# Altium project Design 1 - Telemetry Module.PrjPcb (part 1 of 2)
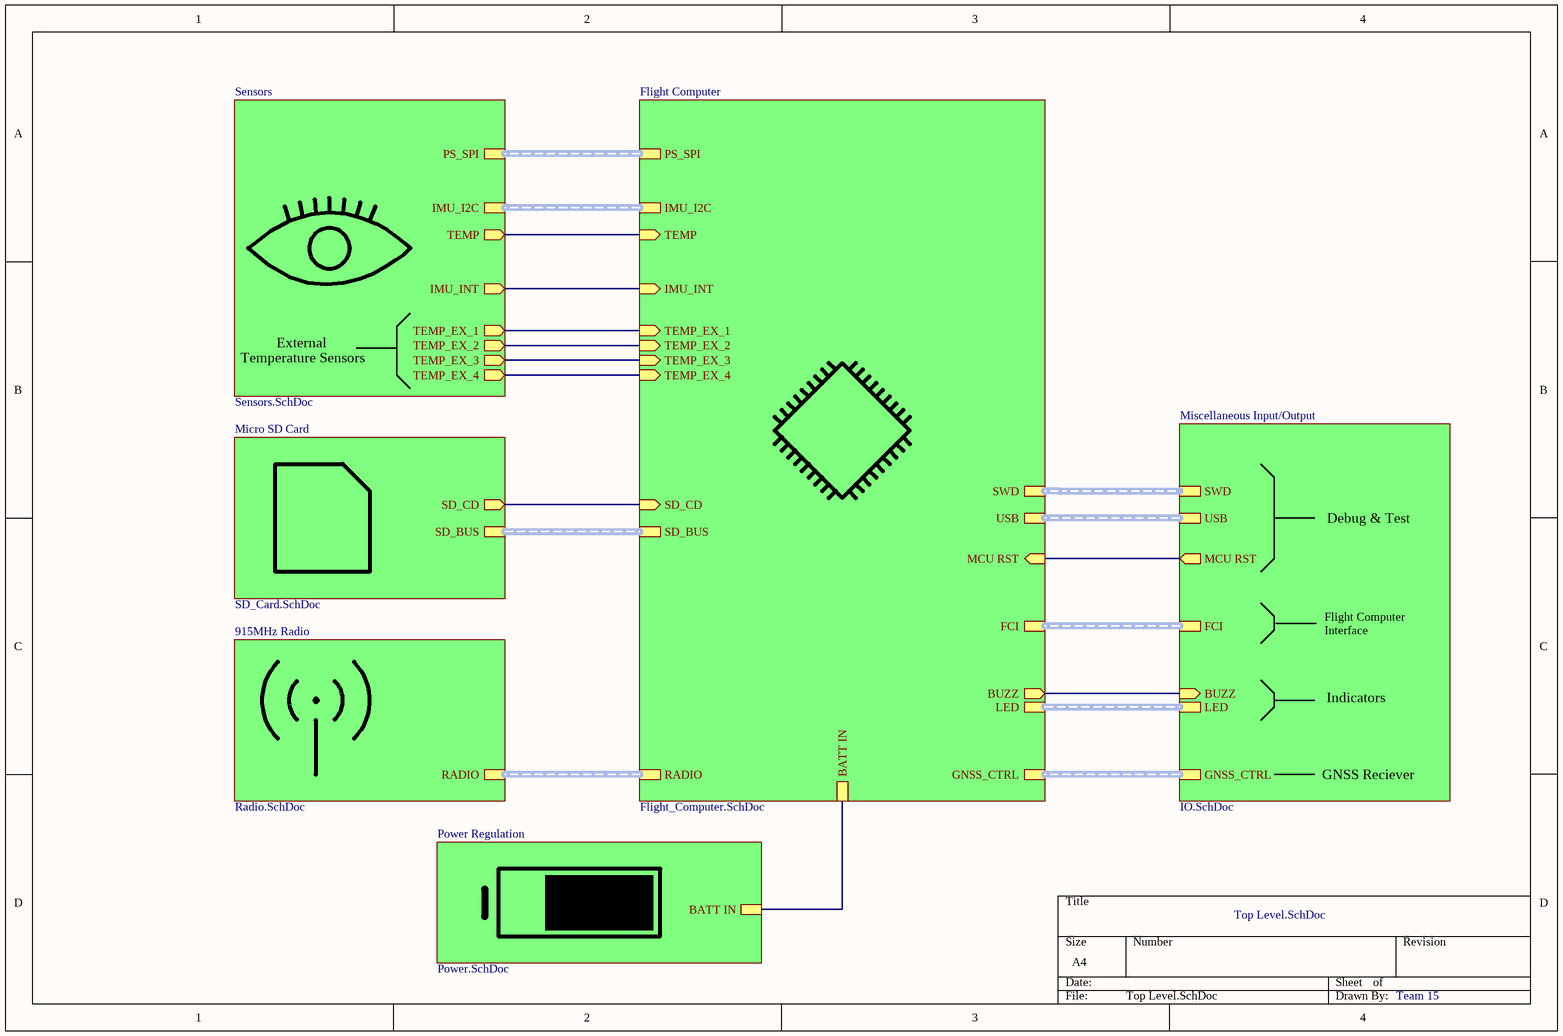
[diagram p0: Top Level.SchDoc]
7 sheets, 76 parts. Net scope: hierarchical (ports join the sheet entries above them; power ports are global).
Board file: Telemetry Module PCB.PcbDoc
Sheets:
  Top Level.SchDoc
    Flight Computer = Flight_Computer.SchDoc
    Micro SD Card = SD_Card.SchDoc
    915MHz Radio = Radio.SchDoc
    Sensors = Sensors.SchDoc
    Miscellaneous Input/Output = IO.SchDoc
    Power Regulation = Power.SchDoc

## Sheet Top Level.SchDoc: ELEC5551 Telemetry PCB
size A4; Author: Team 15; DrawnBy: Team 15; Engineer: Team 15; SheetNumber: 1; SheetTotal: 6

### Sub-sheets
915MHz Radio = Radio.SchDoc: RADIO (harness RADIO)
Flight Computer = Flight_Computer.SchDoc: SD_CD (in), TEMP (in), IMU_INT (in), BUZZ (out), MCU RST (in), GNSS_CTRL (harness GNSS_CTRL), IMU_I2C (harness IMU_I2C), LED (harness LED), PS_SPI (harness PS_SPI), RADIO (harness RADIO), SD_BUS (harness SD_BUS), USB (harness USB), SWD (harness SWD), BATT IN, FCI (harness Flight Computer Interface), TEMP_EX_1 (in), TEMP_EX_2 (in), TEMP_EX_3 (in), TEMP_EX_4 (in)
Micro SD Card = SD_Card.SchDoc: SD_CD (out), SD_BUS (harness SD_BUS)
Miscellaneous Input/Output = IO.SchDoc: LED (harness LED), GNSS_CTRL (harness GNSS_CTRL), MCU RST (out), BUZZ (in), USB (harness USB), SWD (harness SWD), FCI (harness Flight Computer Interface)
Power Regulation = Power.SchDoc: BATT IN
Sensors = Sensors.SchDoc: TEMP (out), IMU_INT (out), PS_SPI (harness PS_SPI), IMU_I2C (harness IMU_I2C), TEMP_EX_1 (out), TEMP_EX_2 (out), TEMP_EX_3 (out), TEMP_EX_4 (out)

### Nets
NetC3_2: sheet Flight Computer/MCU RST, sheet Miscellaneous Input/Output/MCU RST
NetC24_2: sheet Flight Computer/TEMP, sheet Sensors/TEMP
NetC25_2: sheet Flight Computer/TEMP_EX_1, sheet Sensors/TEMP_EX_1
NetC26_2: sheet Flight Computer/TEMP_EX_3, sheet Sensors/TEMP_EX_3
NetC27_2: sheet Flight Computer/TEMP_EX_2, sheet Sensors/TEMP_EX_2
NetC28_2: sheet Flight Computer/TEMP_EX_4, sheet Sensors/TEMP_EX_4
NetD4_1: sheet Flight Computer/BATT IN, sheet Power Regulation/BATT IN
NetIC2_51: sheet Flight Computer/IMU_INT, sheet Sensors/IMU_INT
NetIC2_54: sheet Flight Computer/BUZZ, sheet Miscellaneous Input/Output/BUZZ
NetIC2_64: sheet Flight Computer/SD_CD, sheet Micro SD Card/SD_CD

### Buses and harness runs
harness sheet 915MHz Radio/RADIO = sheet Flight Computer/RADIO
harness sheet Flight Computer/FCI = sheet Miscellaneous Input/Output/FCI
harness sheet Flight Computer/GNSS_CTRL = sheet Miscellaneous Input/Output/GNSS_CTRL
harness sheet Flight Computer/IMU_I2C = sheet Sensors/IMU_I2C
harness sheet Flight Computer/LED = sheet Miscellaneous Input/Output/LED
harness sheet Flight Computer/PS_SPI = sheet Sensors/PS_SPI
harness sheet Flight Computer/SD_BUS = sheet Micro SD Card/SD_BUS
harness sheet Flight Computer/SWD = sheet Miscellaneous Input/Output/SWD
harness sheet Flight Computer/USB = sheet Miscellaneous Input/Output/USB

### Notes on the sheet
- Temperature Sensors
- External
- Debug & Test
- Flight Computer Interface
- Indicators
- GNSS Reciever

## Sheet Flight_Computer.SchDoc
size A4; SheetNumber: 6; SheetTotal: 7
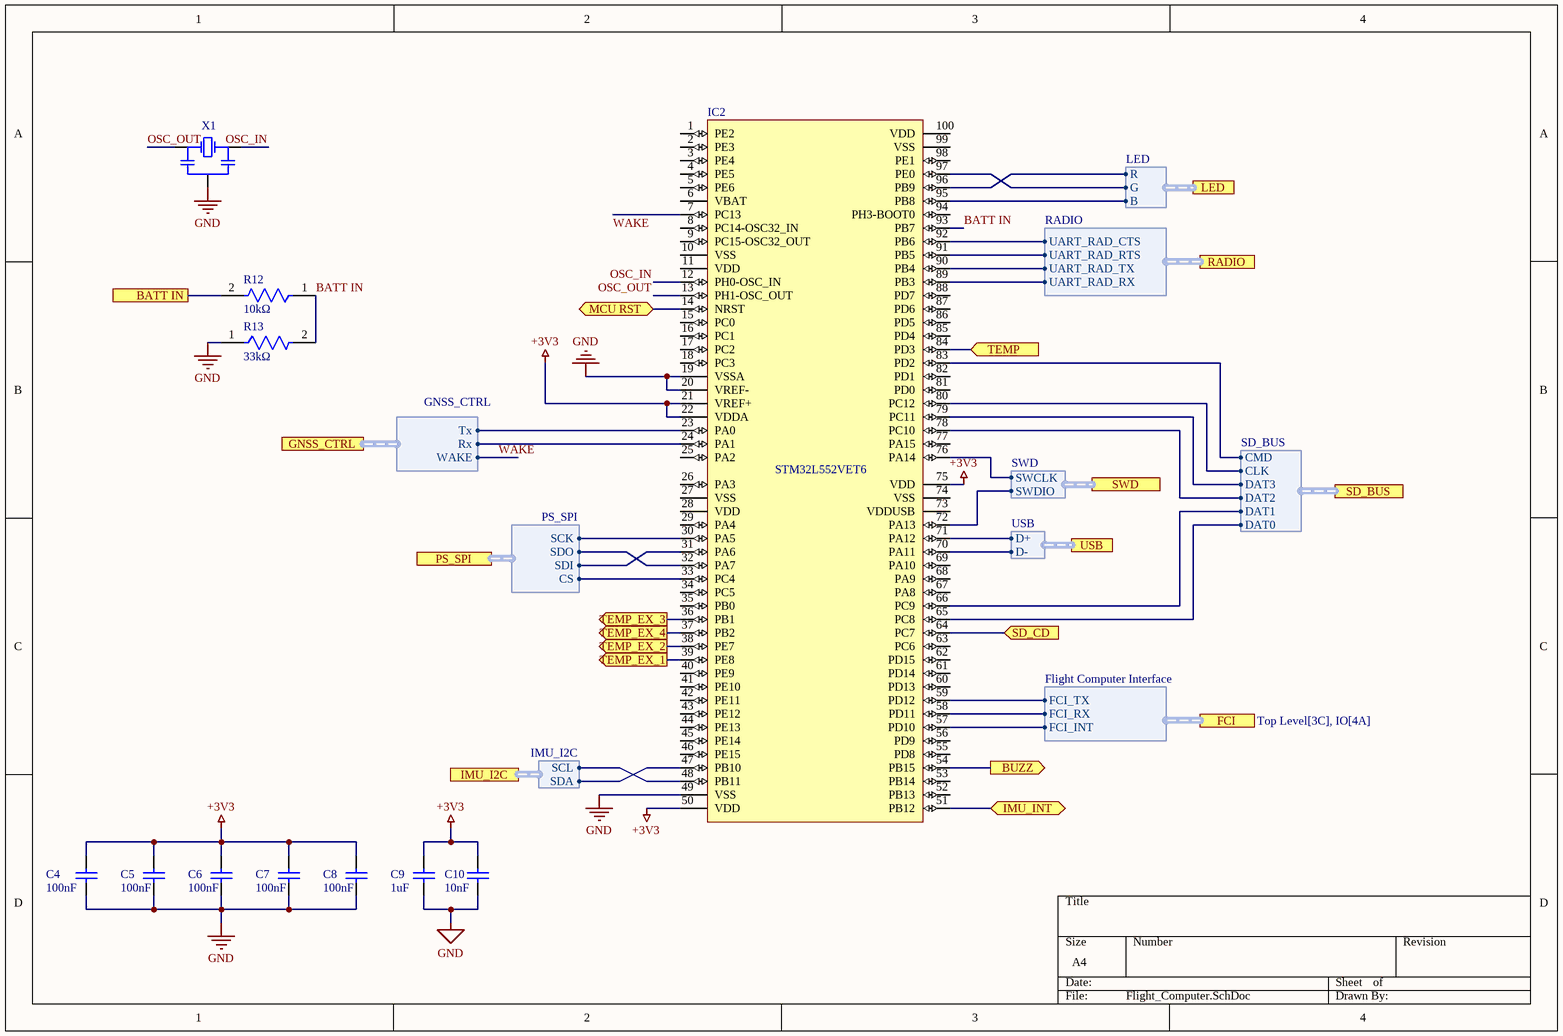
[diagram p1: Flight_Computer.SchDoc]

### Parts
C4  value 100nF  [CAPC1608X10N]  (hidden comment: C0603C104M5RACTU)
C5  value 100nF  [CAPC1608X10N]  (hidden comment: C0603C104M5RACTU)
C6  value 100nF  [CAPC1608X10N]  (hidden comment: C0603C104M5RACTU)
C7  value 100nF  [CAPC1608X10N]  (hidden comment: C0603C104M5RACTU)
C8  value 100nF  [CAPC1608X10N]  (hidden comment: C0603C104M5RACTU)
C9  value 1uF  [CAPC1608X10N]  (hidden comment: C0603C105K8PACTU)
C10  value 10nF  [CAPC1608X10N]  (hidden comment: C0603C103J5RACTU)
IC2  STM32L552VET6  [TSQFP50P1600X1600X160-100N]
R12  10kΩ  [FP-RT0603-MFG]
R13  33kΩ  [FP-CRCW0603-e3-IPC_A]
X1  CSTNE16M0V530000R0  [FP-CSTNE16M0V530000R0-MFG]  (value not drawn)

### Ports
BATT IN (see Top Level[3D], Power[2B]), BUZZ (out, see Top Level[3C], IO[3B]), FCI (harness Flight Computer Interface, see Top Level[3C], IO[4A]), GNSS_CTRL (harness GNSS_CTRL, see Top Level[3D], IO[2B]), IMU_I2C (harness IMU_I2C, see Top Level[2A], Sensors[3C]), IMU_INT (bidir, see Top Level[2B], Sensors[1C]), LED (harness LED, see Top Level[3C], IO[3C]), MCU RST (bidir, see Top Level[3C], IO[2A], IO[2C]), PS_SPI (harness PS_SPI, see Top Level[2A], Sensors[1A]), RADIO (harness RADIO, see Top Level[2D], Radio[3B]), SD_BUS (harness SD_BUS, see Top Level[2C], SD_Card[1B]), SD_CD (in, see Top Level[2B], SD_Card[4B]), SWD (harness SWD, see Top Level[3B], IO[3B]), TEMP (in, see Top Level[2A], Sensors[4A]), TEMP_EX_1 (out, see Top Level[2B], Sensors[4B]), TEMP_EX_2 (out, see Top Level[2B], Sensors[4C]), TEMP_EX_3 (out, see Top Level[2B], Sensors[4B]), TEMP_EX_4 (out, see Top Level[2B], Sensors[4C]), USB (harness USB, see Top Level[3C], IO[1C])

### Harnesses
SD_BUS: CLK, CMD, DAT0, DAT1, DAT2, DAT3
IMU_I2C: SCL, SDA
RADIO: UART_RAD_CTS, UART_RAD_RTS, UART_RAD_TX, UART_RAD_RX
PS_SPI: SCK, SDI, SDO, CS
USB: D+, D-
SWD: SWCLK, SWDIO
LED: B, G, R
GNSS_CTRL: Rx, Tx, WAKE
Flight Computer Interface: FCI_TX, FCI_RX, FCI_INT

### Nets
+3V3: C4.2 C5.2 C6.2 C7.2 C8.2 C9.2 C10.2 IC2.21(VREF+) IC2.22(VDDA) IC2.50(VDD) IC2.75(VDD)
GND: C4.1 C5.1 C6.1 C7.1 C8.1 C9.1 C10.1 IC2.19(VSSA) IC2.20(VREF-) IC2.49(VSS) R13.1 X1.2(GND)
BATT IN: IC2.93(PB7) R12.1 R13.2
CLK: IC2.80(PC12) ; port SD_BUS.CLK
CMD: IC2.83(PD2) ; port SD_BUS.CMD
D2_N: IC2.70(PA11) ; port USB.D-
D2_P: IC2.71(PA12) ; port USB.D+
DAT0: IC2.65(PC8) ; port SD_BUS.DAT0
DAT1: IC2.66(PC9) ; port SD_BUS.DAT1
DAT2: IC2.78(PC10) ; port SD_BUS.DAT2
DAT3: IC2.79(PC11) ; port SD_BUS.DAT3
OSC_IN: IC2.12(PH0-OSC_IN) X1.1(OSC_IN)
OSC_OUT: IC2.13(PH1-OSC_OUT) X1.3(OSC_OUT)
Rx: IC2.24(PA1) ; port GNSS_CTRL.Rx
SCK: IC2.30(PA5) ; port PS_SPI.SCK
SDI: IC2.31(PA6) ; port PS_SPI.SDI
SDO: IC2.32(PA7) ; port PS_SPI.SDO
Tx: IC2.23(PA0) ; port GNSS_CTRL.Tx
WAKE: IC2.7(PC13) ; port GNSS_CTRL.WAKE
NetC3_2: IC2.14(NRST) ; port MCU RST
NetC24_2: IC2.84(PD3) ; port TEMP
NetC25_2: IC2.39(PE8) ; port TEMP_EX_1
NetC26_2: IC2.36(PB1) ; port TEMP_EX_3
NetC27_2: IC2.38(PE7) ; port TEMP_EX_2
NetC28_2: IC2.37(PB2) ; port TEMP_EX_4
NetD3_2: IC2.95(PB8) ; port LED.B
NetD3_5: IC2.96(PB9) ; port LED.R
NetD3_6: IC2.97(PE0) ; port LED.G
NetD4_1: R12.2 ; port BATT IN
NetIC2_33: IC2.33(PC4) ; port PS_SPI.CS
NetIC2_47: IC2.47(PB10) ; port IMU_I2C.SDA
NetIC2_48: IC2.48(PB11) ; port IMU_I2C.SCL
NetIC2_51: IC2.51(PB12) ; port IMU_INT
NetIC2_54: IC2.54(PB15) ; port BUZZ
NetIC2_57: IC2.57(PD10) ; port FCI.FCI_INT
NetIC2_58: IC2.58(PD11) ; port FCI.FCI_RX
NetIC2_59: IC2.59(PD12) ; port FCI.FCI_TX
NetIC2_64: IC2.64(PC7) ; port SD_CD
NetIC2_72: IC2.72(PA13) ; port SWD.SWDIO
NetIC2_76: IC2.76(PA14) ; port SWD.SWCLK
NetIC2_89: IC2.89(PB3) ; port RADIO.UART_RAD_RX
NetIC2_90: IC2.90(PB4) ; port RADIO.UART_RAD_TX
NetIC2_91: IC2.91(PB5) ; port RADIO.UART_RAD_RTS
NetIC2_92: IC2.92(PB6) ; port RADIO.UART_RAD_CTS

Not connected (* = marked no-connect by the designer): IC2 1(PE2) 2(PE3) 3(PE4) 4(PE5) 5(PE6) 6(VBAT) 8(PC14-OSC32_IN) 9(PC15-OSC32_OUT) 10(VSS) 11(VDD) 15(PC0) 16(PC1) 17(PC2) 18(PC3) 25(PA2) 26(PA3) 27(VSS) 28(VDD) 29(PA4) 34(PC5) 35(PB0) 40(PE9) 41(PE10) 42(PE11) 43(PE12) 44(PE13) 45(PE14) 46(PE15) 52(PB13) 53(PB14) 55(PD8) 56(PD9) 60(PD13) 61(PD14) 62(PD15) 63(PC6) 67(PA8) 68(PA9) 69(PA10) 73(VDDUSB) 74(VSS) 77(PA15) 81(PD0) 82(PD1) 85(PD4) 86(PD5) 87(PD6) 88(PD7) 94(PH3-BOOT0) 98(PE1) 99(VSS) 100(VDD)

### Library data of the parts
C4-C8 = CMP-00038-5: Cap Ceramic 0.1uF 50V X7R 20% SMD 0603 125C T/R; Dissipation Factor: 2.5%; Min Operating Temperature: -55°C; Contact Plating: Tin,Matte; Height: 0.8mm; Voltage Rating: 50V; REACH SVHC: No SVHC; Max Operating Temperature: 125°C; Termination: SMD/SMT; Package Quantity: 1; Capacitance: 100nF; Packaging: Tape and Reel; Width: 0.031inch; Depth: 0.8mm; Dielectric: X7R; Tolerance: 20%; Lead Pitch: 0.7mm; Thickness: 0.034inch; Length: 1.6mm; Dielectric Material: Ceramic; Radiation Hardening: No; Voltage Rating (DC): 50V; Case/Package: 0603; Case Code (Metric): 1608; Mount: Surface Mount,PCB; Case Code (Imperial): 0603; JLC_PN: C14663
C9 = CMP-00045-2: Cap Ceramic 1uF 10V X5R 10% SMD 0603 85°C Paper T/R; Capacitance: 1uF; Voltage Rating (DC): 10V; Case/Package: 0603; Height: 0.8mm; Tolerance: 10%; Width: 0.031inch; Lead Free: Lead Free; Mount: Surface Mount; Length: 1.6mm; Number of Pins: 2; Radiation Hardening: No; Dielectric: X5R; Voltage: 10V; Depth: 0.8mm; Weight: 7.1E-05oz; REACH SVHC: No SVHC; Package Quantity: 1; Max Operating Temperature: 85°C; Case Code (Imperial): 0603; Thickness: 0.035inch; Min Operating Temperature: -55°C; Dielectric Material: Ceramic; Case Code (Metric): 1608; Packaging: Tape and Reel; Voltage Rating: 10V; Termination: SMD/SMT; JLC_PN: C15849
C10 = CMP-00047-2: Cap Ceramic 0.01uF 50V X7R 5% SMD 0603 125C Paper T/R; Dielectric: X7R; Case/Package: 0603; Height: 0.8mm; Capacitance: 10nF; Depth: 0.8mm; Length: 1.6mm; Min Operating Temperature: -55°C; Radiation Hardening: No; Packaging: Tape and Reel; Max Operating Temperature: 125°C; Mount: Surface Mount; Tolerance: 5%; JLC_PN: C57112
IC2 = CMP-00012-1: STM32L Series 512 kB Flash 256 KB RAM SMT 32-Bit Microcontroller - LQFP-100
R12 = CMP-2000-04608-2: RES SMD 10K OHM 0.5% 1/10W 0603; Manufacturer Part Number: RT0603DRE0710KL; Manufacturer: Yageo; Tolerance: 0.005; Temperature Coefficient: 50 ppm/°C; Voltage Rating: 75V; Power Rating: 0.1W; Temperature Range Low: -55°C; ComponentLink2Description: Datasheet; RoHS: TRUE; Device Class L1: Passive Components; Octopart: https://octopart.com/rt0603dre0710kl-yageo-1185844; Mouser Description: Thin Film Resistors - SMD 10K ohm 0.5% 1/10W; Automotive: No; Device Class L2: Resistors; Device Class L3: Chip SMD Resistors; Footprint Url: http://www.yageo.com/exep/pages/download/literatures/PYu-R_Mount_10.pdf; Temperature Range High: +155°C; Series: RT; Value: 10KΩ; Package: RT0603; Resistance: 10KΩ; Category: Res; Temperature: -55°C to +155°C; Height: 0.55mm; ComponentLink2URL: http://www.yageo.com/documents/recent/PYu-RT_1-to-0.01_RoHS_L_9.pdf; Lead Free: Yes; Composition: Thin Film; Digikey Description: RES SMD 10K OHM 0.5% 1/10W 0603; Ipc Land Pattern Name: RESC16080X45
R13 = CMP-2000-03245-2: RES Thick Film, 33kΩ, 1%, 0.1W, 100ppm/°C, 0603; Voltage Rating: 75V; Resistance: 33kR; Max Power Dissipation: 100mW; Contact Plating: Tin; Min Operating Temperature: -55°C; Radiation Hardening: No; Package Quantity: 10; Tolerance: 1%; Termination: SMD/SMT; Case Code (Metric): 1608; Military Standard: Not; Packaging: Tape and Reel; Case/Package: 0603; Composition: Thick Film; Depth: 0.85mm; Weight: 7.1E-05oz; Max Operating Temperature: 155°C; Height: 0.45mm; Features: Automotive AEC-Q200; Width: 0.033inch; Length: 1.55mm; Power Rating: 100mW; Voltage Rating (DC): 75V; Temperature Coefficient: 100ppm/°C; Case Code (Imperial): 0603; Mount: Surface Mount; Number of Terminations: 2; Lead Free: Lead Free
X1 = CMP-00029-1: CER RES 16.0000MHZ 15PF SMD; Frequency Tolerance: 0.5%; Frequency: 16MHz; Impedance: 40R; Frequency Stability: 0.3%; Capacitance: 15pF; Max Operating Temperature: 85°C; Mount: Surface Mount; Min Operating Temperature: -40°C; Case/Package: SMD/SMT; Packaging: Tape and Reel; Composition: Ceramic

## Sheet SD_Card.SchDoc
size A4; SheetNumber: 3; SheetTotal: 7
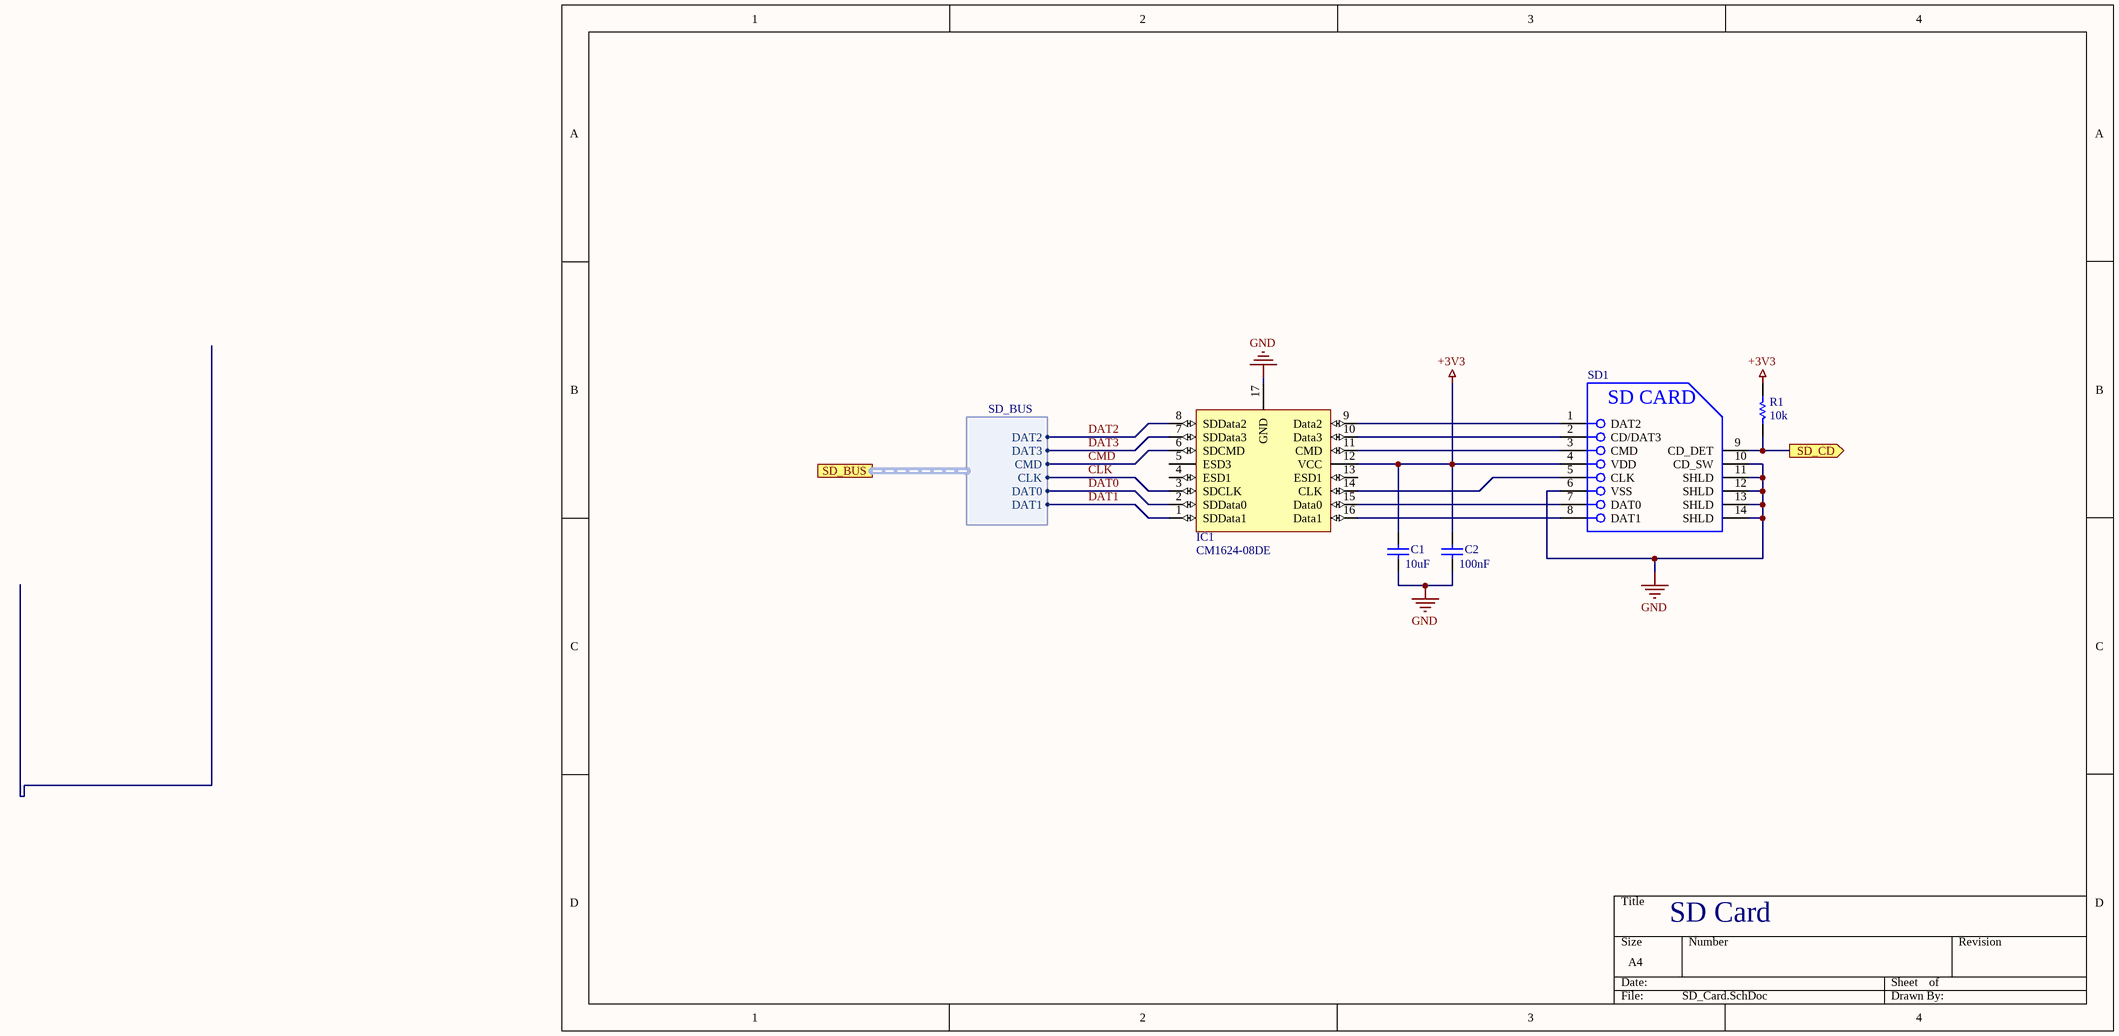
[diagram p2: SD_Card.SchDoc]

### Parts
C1  value 10uF  [CAPC2012X14N]  (hidden comment: C0805C106K8PACTU)
C2  value 100nF  [CAPC1608X10N]  (hidden comment: C0603C104M5RACTU)
IC1  CM1624-08DE  [SON40P140X55_HS-17N]
R1  value 10k  [RESC1608X06N]  (hidden comment: CRCW060310K0FKEA)
SD1  5027740891  [5027740891-Footprint-1]  (value not drawn)

### Ports
SD_BUS (harness SD_BUS, see Top Level[2C], Flight_Computer[4B]), SD_CD (out, see Top Level[2B], Flight_Computer[3C])

### Harnesses
SD_BUS: DAT1, DAT0, CLK, CMD, DAT3, DAT2

### Nets
+3V3: C1.2 C2.2 IC1.12(VCC) R1.2 SD1.4(VDD)
GND: C1.1 C2.1 IC1.17(GND) SD1.6(VSS) SD1.10(CD_SW) SD1.11(SHLD) SD1.12(SHLD) SD1.13(SHLD) SD1.14(SHLD)
CLK: IC1.3(SDCLK) ; port SD_BUS.CLK
CMD: IC1.6(SDCMD) ; port SD_BUS.CMD
DAT0: IC1.2(SDData0) ; port SD_BUS.DAT0
DAT1: IC1.1(SDData1) ; port SD_BUS.DAT1
DAT2: IC1.8(SDData2) ; port SD_BUS.DAT2
DAT3: IC1.7(SDData3) ; port SD_BUS.DAT3
NetIC1_9: IC1.9(Data2) SD1.1(DAT2)
NetIC1_10: IC1.10(Data3) SD1.2(CD/DAT3)
NetIC1_11: IC1.11(CMD) SD1.3(CMD)
NetIC1_14: IC1.14(CLK) SD1.5(CLK)
NetIC1_15: IC1.15(Data0) SD1.7(DAT0)
NetIC1_16: IC1.16(Data1) SD1.8(DAT1)
NetIC2_64: R1.1 SD1.9(CD_DET) ; port SD_CD

Not connected (* = marked no-connect by the designer): IC1 4(ESD1) 5(ESD3) 13(ESD1)

### Notes on the sheet
- SD Card
- (in symbol CMP-00007-2) SD CARD

### Library data of the parts
C1 = CMP-00046-3: CAP CER 10UF 10V X5R 0805; Dielectric Material: Ceramic; Dissipation Factor: 10%; Width: 1.2mm; Number of Pins: 2; Voltage: 10V; Packaging: Tape and Reel; Dielectric: X5R; Mount: Surface Mount; Case/Package: 0805; Thickness: 0.055inch; Package Quantity: 1; Voltage Rating (DC): 10V; Case Code (Imperial): 0805; Tolerance: 10%; Max Operating Temperature: 85°C; Radiation Hardening: No; Termination: SMD/SMT; Height: 1.25mm; Voltage Rating: 10V; Capacitance: 10uF; Length: 2mm; Min Operating Temperature: -55°C; Depth: 1.25mm; REACH SVHC: No SVHC; Case Code (Metric): 2012; Contact Plating: Tin,Matte; JLC_PN: C15850
C2 = CMP-00038-5: as C4 on sheet Flight_Computer; Min Operating Temperature: -55°C; Contact Plating: Tin,Matte; Height: 0.8mm; Voltage Rating: 50V; REACH SVHC: No SVHC; Max Operating Temperature: 125°C; Termination: SMD/SMT; Package Quantity: 1; Capacitance: 100nF; Packaging: Tape and Reel; Width: 0.031inch; Depth: 0.8mm; Dielectric: X7R; Tolerance: 20%; Lead Pitch: 0.7mm; Thickness: 0.034inch; Length: 1.6mm; Dielectric Material: Ceramic; Radiation Hardening: No; Voltage Rating (DC): 50V; Case/Package: 0603; Case Code (Metric): 1608; Mount: Surface Mount,PCB; Case Code (Imperial): 0603; JLC_PN: C14663
IC1 = CMP-00015-3: EMI Filter Flat Style SMD T/R; Capacitance: 20pF; Operating Supply Voltage: 5V; ESD Protection: Yes; Clamping Voltage: 9V; DC Resistance (DCR): 40R; Number of Channels: 6; Number of Lines: 8; Direction: Bidirectional; Depth: 1.45mm; Length: 3.4mm; Height: 0.022inch; Halogen Free: Halogen Free; REACH SVHC: No SVHC; Contact Plating: Tin,Matte; Number of Pins: 16; Termination: Flat; Package Quantity: 1; Min Operating Temperature: -40°C; Lead Free: Lead Free; Packaging: Tape and Reel; Case/Package: DFN; Max Operating Temperature: 85°C; Width: 1.35mm
R1 = CMP-00042-5: VISHAY - CRCW060310K0FKEA - SMD Chip Resistor, 0603 [1608 Metric], 10 kohm, CRCW e3 Series, 75 V, Thick Film, 100 mW; Voltage Rating: 75V; Temperature Coefficient: 100ppm/°C; Resistance: 10kR; Power Rating: 100mW; Tolerance: 1%; Number of Terminations: 2; Termination: SMD/SMT; Weight: 7.1E-05oz; Contact Plating: Tin,Lead; Max Operating Temperature: 155°C; Voltage Rating (DC): 75V; Military Standard: Not; Min Operating Temperature: -55°C; Depth: 0.85mm; Lead Free: Lead Free; Width: 0.033inch; Max Power Dissipation: 100mW; Features: Automotive AEC-Q200; Number of Pins: 2; Package Quantity: 10; Case/Package: 0603; Height: 0.45mm; Radiation Hardening: No; REACH SVHC: Unknown; Packaging: Tape and Reel; Length: 1.55mm; Case Code (Metric): 1608; Case Code (Imperial): 0603; Composition: Thick Film; JLC_PN: C25804
SD1 = CMP-00007-2: MOLEX   502774-0891.   MEMORY CARD CONNECTOR, MICROSD, 8POS; Current Rating: 500mA; Number of Contacts: 8; Pitch: 1.1mm; Gender: Male; Max Voltage Rating (DC): 1.01kV; Voltage Rating (AC): 10V; Max Operating Temperature: 85°C; Radiation Hardening: No; Depth: 16mm; Number of Rows: 1; Mount: Surface Mount,Reverse; Height: 1.8mm; Min Operating Temperature: -25°C; Length: 14.6mm; Package Quantity: 1; Contact Material: Copper Alloy,Copper; Housing Material: Polymer; Width: 1.8mm; Contact Plating: Gold; Orientation: Right Angle; Number of Circuits: 8; REACH SVHC: Unknown; Packaging: Tape and Reel; Halogen Free: Low Halogen; Termination: Solder; Connector Type: Connector

## Sheet Radio.SchDoc
size A4; SheetNumber: 7; SheetTotal: 7
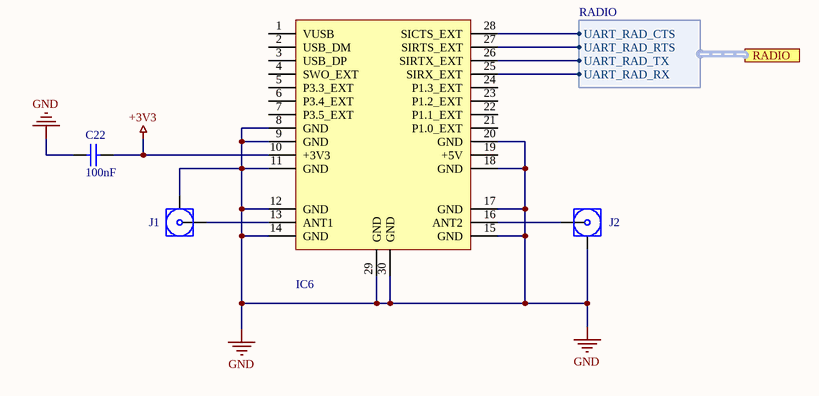
[diagram p3: Radio.SchDoc]

### Parts
C22  value 100nF  [CAPC1608X10N]  (hidden comment: C0603C104M5RACTU)
IC6  RFD900ux  [RFD900ux-Footprint-1]  (value not drawn)
J1  PCB.SMAFST.J.A.HT  [PCB.SMAFST.J.A.HT-Footprint-1]  (value not drawn)
J2  PCB.SMAFST.J.A.HT  [PCB.SMAFST.J.A.HT-Footprint-1]  (value not drawn)

### Ports
RADIO (harness RADIO, see Top Level[2D], Flight_Computer[4B])

### Harnesses
RADIO: UART_RAD_CTS, UART_RAD_RTS, UART_RAD_TX, UART_RAD_RX

### Nets
+3V3: C22.2 IC6.10(+3V3)
GND: C22.1 IC6.8(GND) IC6.9(GND) IC6.11(GND) IC6.12(GND) IC6.14(GND) IC6.15(GND) IC6.17(GND) IC6.18(GND) IC6.20(GND) IC6.29(GND) IC6.30(GND) J1.2(GND) J2.2(GND)
NetIC2_89: IC6.25(SIRX_EXT) ; port RADIO.UART_RAD_RX
NetIC2_90: IC6.26(SIRTX_EXT) ; port RADIO.UART_RAD_TX
NetIC2_91: IC6.27(SIRTS_EXT) ; port RADIO.UART_RAD_RTS
NetIC2_92: IC6.28(SICTS_EXT) ; port RADIO.UART_RAD_CTS
NetIC6_13: IC6.13(ANT1) J1.1(SIG)
NetIC6_16: IC6.16(ANT2) J2.1(SIG)

Not connected (* = marked no-connect by the designer): IC6 1(VUSB) 2(USB_DM) 3(USB_DP) 4(SWO_EXT) 5(P3.3_EXT) 6(P3.4_EXT) 7(P3.5_EXT) 19(+5V) 21(P1.0_EXT) 22(P1.1_EXT) 23(P1.2_EXT) 24(P1.3_EXT)

### Library data of the parts
C22 = CMP-00038-5: as C4 on sheet Flight_Computer; Dielectric Material: Ceramic; Voltage Rating: 50V; Lead Pitch: 0.7mm; Package Quantity: 1; Case Code (Metric): 1608; Tolerance: 20%; Termination: SMD/SMT; Min Operating Temperature: -55°C; Height: 0.8mm; Voltage Rating (DC): 50V; Contact Plating: Tin,Matte; Case/Package: 0603; Capacitance: 100nF; Length: 1.6mm; Dielectric: X7R; Depth: 0.8mm; Mount: Surface Mount,PCB; Thickness: 0.034inch; Width: 0.031inch; REACH SVHC: No SVHC; Packaging: Tape and Reel; Case Code (Imperial): 0603; Max Operating Temperature: 125°C; Radiation Hardening: No; JLC_PN: C14663
IC6 = CMP-00019-3: Long range surface mount radio module 902-928Mhz
J1 J2 = CMP-00234-3: CONN SMA JACK STR 50OHM PCB; Impedance: 50R; Body Plating: Gold; Polarity: Standard; Operating Frequency: 0 to 12.4 GHz; Max Frequency: 12.4GHz; Insulation Resistance: 5GR; Voltage Rating: 335V; Dielectric Material: PTFE; Body Material: Brass; Connector Type: SMA; Plating: Gold; Mount: Surface Mount; Center Contact Plating: Gold; Frequency: 12.4GHz; Series: -; Case/Package: SMA; Contact Material: Bronze; Fastening Type: Threaded; Housing Color: Gold; Packaging: Tray; Contact Plating: Gold; Orientation: Straight; Package Quantity: 500; Termination: Solder

## Sheet Sensors.SchDoc
size A4; SheetNumber: 5; SheetTotal: 7
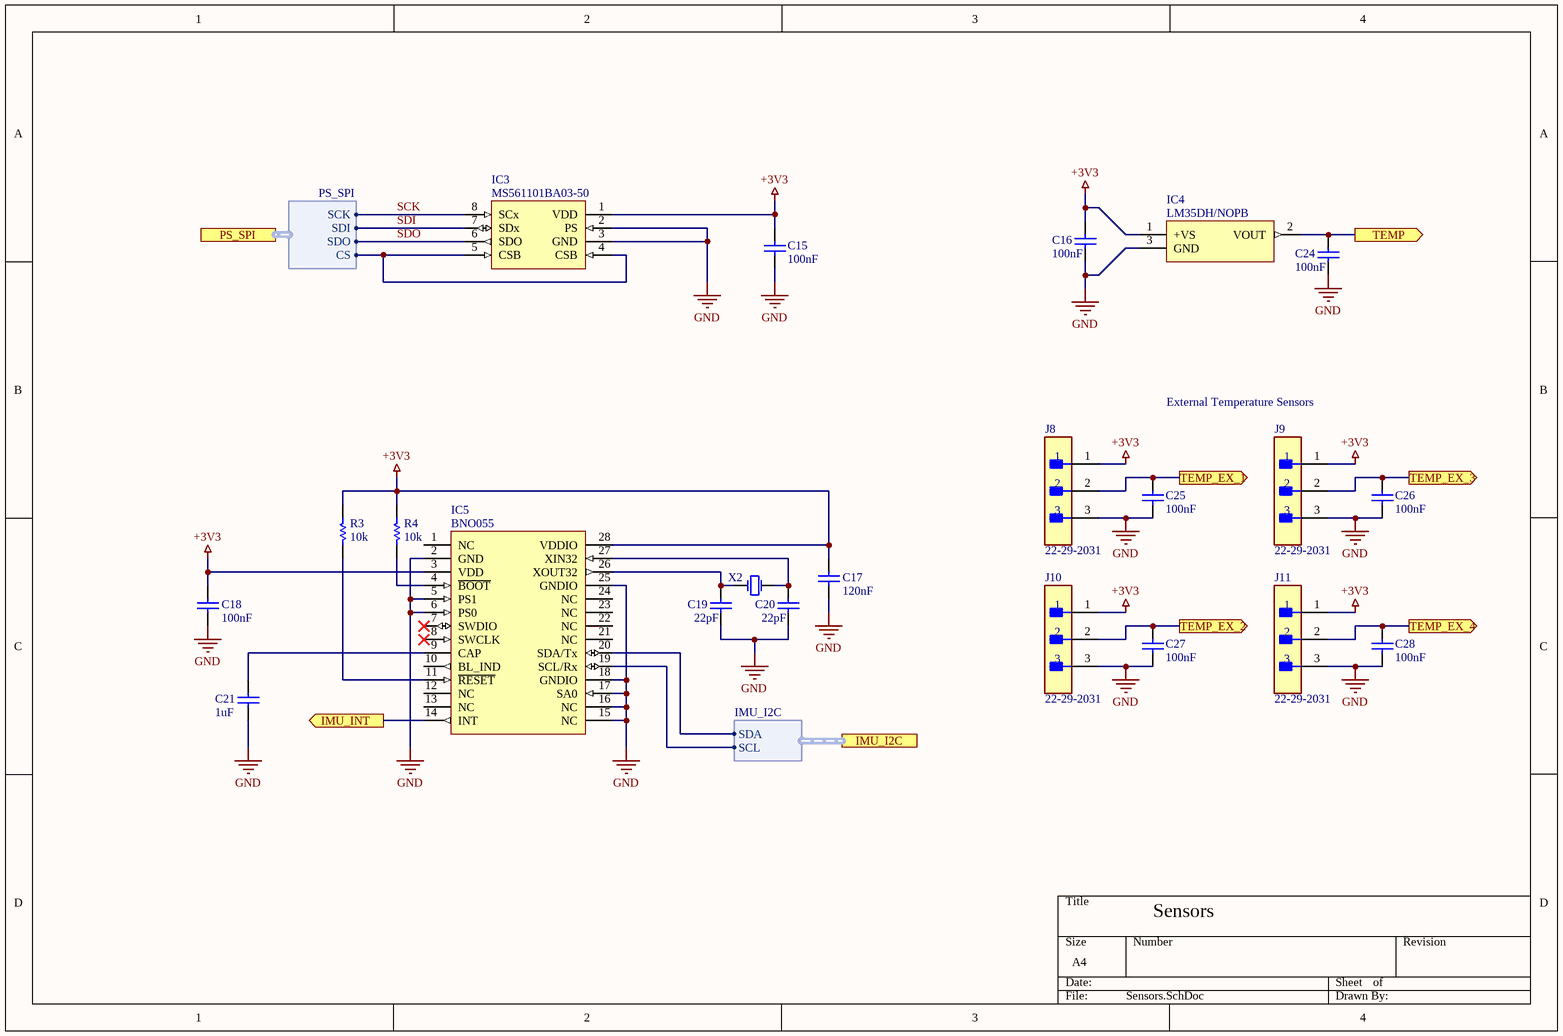
[diagram p4: Sensors.SchDoc]

### Parts
C15  value 100nF  [CAPC1608X10N]  (hidden comment: C0603C104M5RACTU)
C16  Capacitance: 100nF  [CAPC1608X10N]  (hidden comment: C0603C104M5RACTU)
C17  value 120nF  [CAPC1608X10N]  (hidden comment: C0603C124K4RACTU)
C18  value 100nF  [CAPC1608X10N]  (hidden comment: C0603C104M5RACTU)
C19  value 22pF  [CAPC1005X05N]  (hidden comment: C0402C220K5GACTU)
C20  value 22pF  [CAPC1005X05N]  (hidden comment: C0402C220K5GACTU)
C21  value 1uF  [CAPC1608X10N]  (hidden comment: C0603C105K8PACTU)
C24  Capacitance: 100nF  [CAPC1608X10N]  (hidden comment: C0603C104M5RACTU)
C25  value 100nF  [CAPC1608X10N]  (hidden comment: C0603C104M5RACTU)
C26  value 100nF  [CAPC1608X10N]  (hidden comment: C0603C104M5RACTU)
C27  value 100nF  [CAPC1608X10N]  (hidden comment: C0603C104M5RACTU)
C28  value 100nF  [CAPC1608X10N]  (hidden comment: C0603C104M5RACTU)
IC3  MS561101BA03-50  [MS561101BA03-50-Footprint-1]
IC4  LM35DH/NOPB  [LM35DH_NOPB-Footprint-1]
IC5  BNO055  [BNO055-Footprint-1]
J8  22-29-2031  [FP-22-29-2031-MFG]
J9  22-29-2031  [FP-22-29-2031-MFG]
J10  22-29-2031  [FP-22-29-2031-MFG]
J11  22-29-2031  [FP-22-29-2031-MFG]
R3  value 10k  [RESC1608X06N]  (hidden comment: CRCW060310K0FKEA)
R4  value 10k  [RESC1608X06N]  (hidden comment: CRCW060310K0FKEA)
X2  ABS07-32.768KHZ-T  [ABS07-32.768KHZ-T-Footprint-1]  (value not drawn)

### Ports
IMU_I2C (harness IMU_I2C, see Top Level[2A], Flight_Computer[2D]), IMU_INT (out, see Top Level[2B], Flight_Computer[3D]), PS_SPI (harness PS_SPI, see Top Level[2A], Flight_Computer[2C]), TEMP (out, see Top Level[2A], Flight_Computer[3B]), TEMP_EX_1 (out, see Top Level[2B], Flight_Computer[2C]), TEMP_EX_2 (out, see Top Level[2B], Flight_Computer[2C]), TEMP_EX_3 (out, see Top Level[2B], Flight_Computer[2C]), TEMP_EX_4 (out, see Top Level[2B], Flight_Computer[2C])

### Harnesses
PS_SPI: SCK, SDI, SDO, CS
IMU_I2C: SCL, SDA

### Nets
+3V3: C15.2 C16.2 C17.2 C18.2 IC3.1(VDD) IC4.1(+VS) IC5.3(VDD) IC5.28(VDDIO) J8.1 J9.1 J10.1 J11.1 R3.2 R4.2
GND: C15.1 C16.1 C17.1 C18.1 C19.1 C20.1 C21.1 C24.1 C25.1 C26.1 C27.1 C28.1 IC3.2(PS) IC3.3(GND) IC4.3(GND) IC5.2(GND) IC5.5(PS1) IC5.6(PS0) IC5.15(NC) IC5.16(NC) IC5.17(SA0) IC5.18(GNDIO) IC5.25(GNDIO) J8.3 J9.3 J10.3 J11.3
SCK: IC3.8(SCx) ; port PS_SPI.SCK
SDI: IC3.7(SDx) ; port PS_SPI.SDI
SDO: IC3.6(SDO) ; port PS_SPI.SDO
NetC19_2: C19.2 IC5.26(XOUT32) X2.1(OSC1)
NetC20_2: C20.2 IC5.27(XIN32) X2.2(OSC2)
NetC21_2: C21.2 IC5.9(CAP)
NetC24_2: C24.2 IC4.2(VOUT) ; port TEMP
NetC25_2: C25.2 J8.2 ; port TEMP_EX_1
NetC26_2: C26.2 J9.2 ; port TEMP_EX_3
NetC27_2: C27.2 J10.2 ; port TEMP_EX_2
NetC28_2: C28.2 J11.2 ; port TEMP_EX_4
NetIC2_33: IC3.4(CSB) IC3.5(CSB) ; port PS_SPI.CS
NetIC2_47: IC5.20(SDA/Tx) ; port IMU_I2C.SDA
NetIC2_48: IC5.19(SCL/Rx) ; port IMU_I2C.SCL
NetIC2_51: IC5.14(INT) ; port IMU_INT
NetIC5_4: IC5.4(~{BOOT}) R4.1
NetIC5_11: IC5.11(~{RESET}) R3.1

Not connected (* = marked no-connect by the designer): IC5 1(NC) 7(SWDIO)* 8(SWCLK)* 10(BL_IND) 12(NC) 13(NC) 21(NC) 22(NC) 23(NC) 24(NC)

### Notes on the sheet
- External Temperature Sensors
- Sensors

### Library data of the parts
C15 C18 C25-C28 = CMP-00038-5: as C4 on sheet Flight_Computer; Dielectric Material: Ceramic; Voltage Rating: 50V; Lead Pitch: 0.7mm; Package Quantity: 1; Case Code (Metric): 1608; Tolerance: 20%; Termination: SMD/SMT; Min Operating Temperature: -55°C; Height: 0.8mm; Voltage Rating (DC): 50V; Contact Plating: Tin,Matte; Case/Package: 0603; Capacitance: 100nF; Length: 1.6mm; Dielectric: X7R; Depth: 0.8mm; Mount: Surface Mount,PCB; Thickness: 0.034inch; Width: 0.031inch; REACH SVHC: No SVHC; Packaging: Tape and Reel; Case Code (Imperial): 0603; Max Operating Temperature: 125°C; Radiation Hardening: No; JLC_PN: C14663
C16 C24 = CMP-00038-5: Cap Ceramic 0.1uF 50V X7R 20% SMD 0603 125C T/R; Value: 100nF; Dissipation Factor: 2.5%; Min Operating Temperature: -55°C; Contact Plating: Tin,Matte; Height: 0.8mm; Voltage Rating: 50V; REACH SVHC: No SVHC; Max Operating Temperature: 125°C; Termination: SMD/SMT; Package Quantity: 1; Packaging: Tape and Reel; Width: 0.031inch; Depth: 0.8mm; Dielectric: X7R; Tolerance: 20%; Lead Pitch: 0.7mm; Thickness: 0.034inch; Length: 1.6mm; Dielectric Material: Ceramic; Radiation Hardening: No; Voltage Rating (DC): 50V; Case/Package: 0603; Case Code (Metric): 1608; Mount: Surface Mount,PCB; Case Code (Imperial): 0603; JLC_PN: C14663
C17 = CMP-00213-1: MLCC CAPACITOR, 0.12UF, 16V, X7R, 10%, 0603, FULL REEL; Product Range:C Series; Capacitance:0.12 F; Capacitance Tolerance: 10%; Dielectric Characteristic:X7R; Voltage Rating:16V; Ceramic Capacitor Case:0603 [1608 Metric] ;RoHS Compliant: Yes; Dissipation Factor: 3.5%; Packaging: Tape and Reel; Height: 0.8mm; Termination: SMD/SMT; Tolerance: 10%; Package Quantity: 1; REACH SVHC: No SVHC; Dielectric Material: Ceramic; Case/Package: 0603; Radiation Hardening: No; Max Operating Temperature: 125°C; RoHS Compliant: Yes; Case Code (Metric): 1608; Width: 0.031inch; Thickness: 0.034inch; Case Code (Imperial): 0603; Voltage Rating (DC): 16V; Dielectric: X7R; Voltage Rating: 16V; Length: 1.6mm; Series: C; Lead Pitch: 0.7mm; Depth: 0.8mm; Min Operating Temperature: -55°C; Capacitance: 120nF; Mount: Surface Mount
C19 C20 = CMP-00083-1: CAP CER 22PF 50V C0G/NP0 0402; Dielectric: C0G; Tolerance: 10%; Dissipation Factor: 0.1%; Dielectric Material: Ceramic; Lead Pitch: 0.3mm; Case Code (Imperial): 0402; Height: 0.5mm; Depth: 0.5mm; Voltage Rating (DC): 50V; Mount: Surface Mount; Voltage Rating: 50V; Width: 0.02inch; Capacitance: 22pF; Radiation Hardening: No; Max Operating Temperature: 125°C; Length: 1mm; Min Operating Temperature: -55°C; Package Quantity: 1; Case Code (Metric): 1005; Termination: SMD/SMT; Case/Package: 0402; REACH SVHC: No SVHC; Lead Free: Lead Free; Packaging: Tape and Reel; Thickness: 0.022inch
C21 = CMP-00045-2: as C9 on sheet Flight_Computer; Capacitance: 1uF; Voltage Rating (DC): 10V; Case/Package: 0603; Height: 0.8mm; Tolerance: 10%; Width: 0.031inch; Lead Free: Lead Free; Mount: Surface Mount; Length: 1.6mm; Number of Pins: 2; Radiation Hardening: No; Dielectric: X5R; Voltage: 10V; Depth: 0.8mm; Weight: 7.1E-05oz; REACH SVHC: No SVHC; Package Quantity: 1; Max Operating Temperature: 85°C; Case Code (Imperial): 0603; Thickness: 0.035inch; Min Operating Temperature: -55°C; Dielectric Material: Ceramic; Case Code (Metric): 1608; Packaging: Tape and Reel; Voltage Rating: 10V; Termination: SMD/SMT; JLC_PN: C15849
IC3 = CMP-00182-2: SENSOR SOLUTIONS - TE CONNECTIVITY - MS561101BA03-50 - MS5611-BT M-CAPS 3X5X1MM T&R / T&R; Operating Pressure: 17.4PSI; Pressure Type: Absolute; Output Type: SPI,I2C; Port Style: No Port; Operating Supply Voltage: 3.6V; Max Pressure: 87.02PSI; Max Operating Temperature: 85°C; Min Operating Temperature: -40°C; Case/Package: SMD/SMT; Lead Free: Lead Free; Number of Pins: 8; Termination: SMD/SMT
IC4 = CMP-00206-1: TEXAS INSTRUMENTS LM35DH/NOPB Temperature Sensor IC, Voltage,  0.6C, 0 C, +100 C, TO-46, 3 Pins; Output Voltage: 6V; Output Type: Analog Voltage,Voltage,Analog; Interface: Analog; Quiescent Current: 56uA; Max Supply Voltage: 30V; Min Supply Voltage: 4V; Output Current: 10mA; Nominal Supply Current: 56.2uA; Contact Plating: Copper,Tin,Silver; Min Operating Temperature: -40°C; Radiation Hardening: No; Number of Pins: 3; Packaging: Bulk; Package Quantity: 1000; Lead Free: Lead Free; REACH SVHC: No SVHC; Mount: Through Hole; Max Operating Temperature: 110°C; Case/Package: TO-46
IC5 = CMP-00179-4: IMU ACCEL/GYRO/MAG I2C 28LGA; Sensor Type: Accelerometer,Gyroscope,Magnetometer,3 Axis; Min Operating Temperature: -40°C; Lead Free: Lead Free; Mount: Surface Mount; Packaging: Tape and Reel; Output Type: I2C; Max Operating Temperature: 85°C; Case/Package: LGA; JLC_PN: C93216
J8-J11 = CMP-04776-000327-1: CONN HEADER VERT 3POS 2.54MM; Contact Resistance: 10mR; Number of Positions: 3; Voltage Rating: 250V; Gender: Male; Connector Type: Male Pin; Current Rating: 4A; Packaging: Bulk; Housing Material: Nylon; Min Operating Temperature: 0°C; Color: Natural; RoHS Compliant: Yes; Housing Color: White; Number of Rows: 1; Pitch: 2.54mm; Mount: Through Hole; Fastening Type: Friction; Length: 7.62mm; Depth: 5.8mm; Contact Material: Brass; Max Operating Temperature: 75°C; Number of Contacts: 3; Contact Type: Male Pin; Working Voltage: 250V; Orientation: Straight; Lead Pitch: 2.54mm; Radiation Hardening: No; Termination: Solder; Contact Plating: Gold; Contact Mating Length: 0.295inch; Series: KK® 6410
R3 R4 = CMP-00042-5: as R1 on sheet SD_Card; Number of Terminations: 2; Termination: SMD/SMT; Weight: 7.1E-05oz; Contact Plating: Tin,Lead; Max Operating Temperature: 155°C; Voltage Rating (DC): 75V; Military Standard: Not; Min Operating Temperature: -55°C; Depth: 0.85mm; Lead Free: Lead Free; Width: 0.033inch; Max Power Dissipation: 100mW; Features: Automotive AEC-Q200; Number of Pins: 2; Package Quantity: 10; Case/Package: 0603; Height: 0.45mm; Radiation Hardening: No; REACH SVHC: Unknown; Packaging: Tape and Reel; Length: 1.55mm; Case Code (Metric): 1608; Case Code (Imperial): 0603; Composition: Thick Film; JLC_PN: C25804
X2 = CMP-00187-2: Crystal; Ulta-Mini; 3.2 x 1.5 x 0.9mm; 32.768KHZ; 12.5pf; 20ppm -40+85C; SMD; T/R; ESR (Equivalent Series Resistance): 70kR; Tolerance: 20ppm; Width: 0.061inch; Number of Pins: 2; Packaging: Tape and Reel; Package Quantity: 3000; Depth: 1.5mm; Height: 0.035inch; Min Operating Temperature: -40°C; Case/Package: CSMD; REACH SVHC: No SVHC; Radiation Hardening: No; Termination: SMD/SMT; Lead Free: Lead Free; Max Operating Temperature: 85°C; Load Capacitance: 12.5pF; Frequency: 32.768kHz; Frequency Tolerance: 20ppm; Length: 3.2mm; Series Resistance: 70kR; JLC_PN: C130253

## Sheet IO.SchDoc
size A4; SheetNumber: 2; SheetTotal: 7
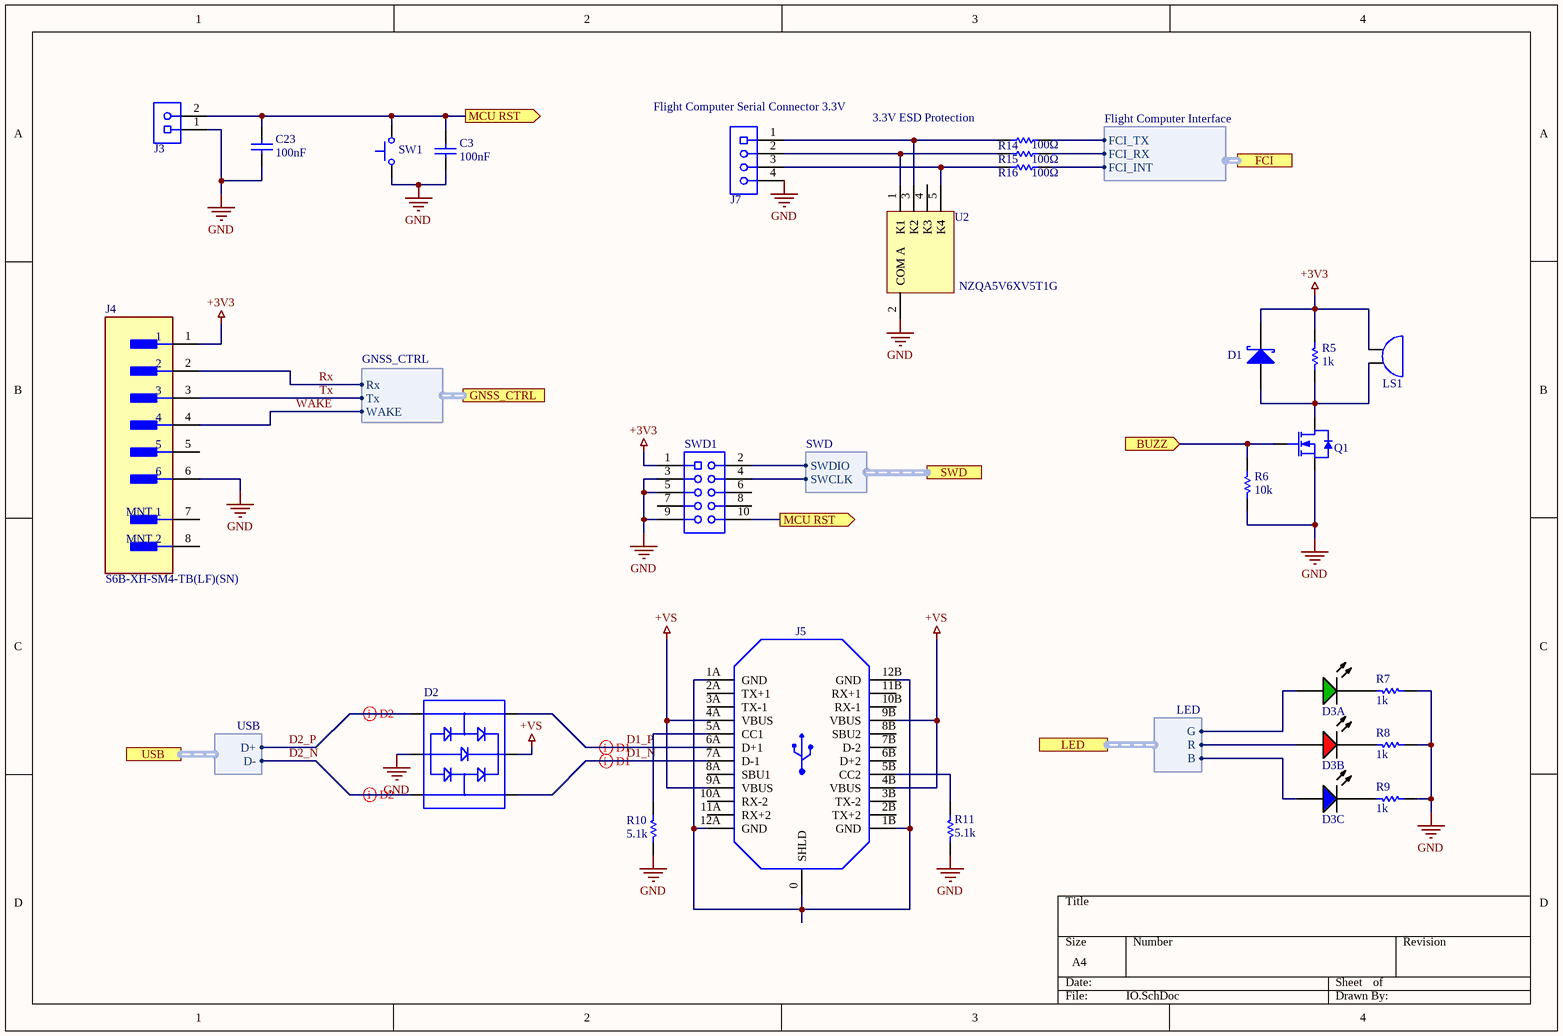
[diagram p5: IO.SchDoc]

### Parts
C3  value 100nF  [CAPC1608X10N]  (hidden comment: C0603C104M5RACTU)
C23  value 100nF  [CAPC1608X10N]  (hidden comment: C0603C104M5RACTU)
D1  RB521S30T1G  [SODFL160X70-2N]  (value not drawn)
D2  USBLC6-2SC6  [USBLC6-2SC6-Footprint-1]  (value not drawn)
D3  LRTBGVSR-U4V2-JW+A6BB-D8+S2U2-7Z-20-S  [LRTBGVSG-UEVE-24+AMAQ-29+SCUC-HR-Footprint-1]  (value not drawn)  (parts A,B,C of 3)
J3  22-28-4020  [22-28-4020-Footprint-1]  (value not drawn)
J4  S6B-XH-SM4-TB(LF)(SN)  [FP-S6B-XH-SM4-TB_LF_SN-MFG]
J5  SS-52400-003  [SS-52400-003-Footprint-1]  (value not drawn)
J7  53426-0410  [53426-0410-Footprint-1]  (value not drawn)
LS1  CMT-8503-85B-SMT-TR  [CMT-8503-85B-SMT-TR-Footprint-1]  (value not drawn)
Q1  2N7002NXAKR  [SOT95P230X110-3N]  (value not drawn)
R5  value 1k  [RESC1608X06N]  (hidden comment: CRCW06031K00FKEA)
R6  value 10k  [RESC1608X06N]  (hidden comment: CRCW060310K0FKEA)
R7  value 1k  [RESC1608X06N]  (hidden comment: CRCW06031K00FKEA)
R8  value 1k  [RESC1608X06N]  (hidden comment: CRCW06031K00FKEA)
R9  value 1k  [RESC1608X06N]  (hidden comment: CRCW06031K00FKEA)
R10  value 5.1k  [RESC1608X06N]  (hidden comment: CRCW06035K10FKEA)
R11  value 5.1k  [RESC1608X06N]  (hidden comment: CRCW06035K10FKEA)
R14  100Ω  [RESC1609X50X30ML8T20]
R15  100Ω  [RESC1609X50X30ML8T20]
R16  100Ω  [RESC1609X50X30ML8T20]
SW1  B3U-1000P  [OMRON-B3U-1000_V]  (value not drawn)
SWD1  M22-2520505  [M22-2520505-Footprint-1]  (value not drawn)
U2  NZQA5V6XV5T1G  [ONSC-SOT-553-5-463B_B_V]

### Ports
BUZZ (in, see Top Level[4C], Flight_Computer[3C]), FCI (harness Flight Computer Interface, see Top Level[4C], Flight_Computer[4C]), GNSS_CTRL (harness GNSS_CTRL, see Top Level[4D], Flight_Computer[1B]), LED (harness LED, see Top Level[4C], Flight_Computer[4A]), MCU RST (out, see Top Level[4C], Flight_Computer[2B]), SWD (harness SWD, see Top Level[4B], Flight_Computer[3B]), USB (harness USB, see Top Level[4C], Flight_Computer[3C])

### Harnesses
USB: D+, D-
SWD: SWDIO, SWCLK
LED: R, G, B
Flight Computer Interface: FCI_TX, FCI_RX, FCI_INT
GNSS_CTRL: Rx, Tx, WAKE

### Nets
+3V3: D1.1(K) J4.1 LS1.1 R5.2 SWD1.1(VDD)
+VS: D2.5 J5.4A(VBUS) J5.4B(VBUS) J5.9A(VBUS) J5.9B(VBUS)
GND: C3.1 C23.1 D2.2 J3.1 J4.6 J7.4 Q1.2(S) R6.1 R7.2 R8.2 R9.2 R10.1 R11.1 SW1.2 SWD1.3(GND) SWD1.5(GND) SWD1.9(GND) U2.2(COM_A)
D1_N: D2.6 J5.7A(D-1)
D1_P: D2.4 J5.6A(D+1)
D2_N: D2.1 ; port USB.D-
D2_P: D2.3 ; port USB.D+
Rx: J4.2 ; port GNSS_CTRL.Rx
Tx: J4.3 ; port GNSS_CTRL.Tx
WAKE: J4.4 ; port GNSS_CTRL.WAKE
NetC3_2: C3.2 C23.2 J3.2 SW1.1 SWD1.10(NRST) ; port MCU RST
NetD1_2: D1.2(A) LS1.2 Q1.3(D) R5.1
NetD3_1: D3.1(K1) R7.1
NetD3_2: D3.2(A3) ; port LED.B
NetD3_3: D3.3(K3) R9.1
NetD3_4: D3.4(K2) R8.1
NetD3_5: D3.5(A2) ; port LED.R
NetD3_6: D3.6(A1) ; port LED.G
NetIC2_54: Q1.1(G) R6.2 ; port BUZZ
NetIC2_57: R16.1 ; port FCI.FCI_INT
NetIC2_58: R15.1 ; port FCI.FCI_RX
NetIC2_59: R14.1 ; port FCI.FCI_TX
NetIC2_72: SWD1.2(SWDIO) ; port SWD.SWDIO
NetIC2_76: SWD1.4(SWCLK) ; port SWD.SWCLK
NetJ5_0: J5.0(SHLD) J5.1A(GND) J5.1B(GND) J5.12A(GND) J5.12B(GND)
NetJ5_5A: J5.5A(CC1) R10.2
NetJ5_5B: J5.5B(CC2) R11.2
NetJ7_1: J7.1 R14.2 U2.3(K2)
NetJ7_2: J7.2 R15.2 U2.1(K1)
NetJ7_3: J7.3 R16.2 U2.5(K4)

Not connected (* = marked no-connect by the designer): J4 5 7(MNT_1) 8(MNT_2); J5 2A(TX+1) 2B(TX+2) 3A(TX-1) 3B(TX-2) 6B(D+2) 7B(D-2) 8A(SBU1) 8B(SBU2) 10A(RX-2) 10B(RX-1) 11A(RX+2) 11B(RX+1); SWD1 6(SWO) 7(NC) 8(NC); U2 4(K3)

### Layout directives
differential pair: D1_N, D1_P, D2_N, D2_P

### Notes on the sheet
- (near J7) Flight Computer Serial Connector 3.3V
- 3.3V ESD Protection

### Library data of the parts
C3 C23 = CMP-00038-5: as C4 on sheet Flight_Computer; Min Operating Temperature: -55°C; Contact Plating: Tin,Matte; Height: 0.8mm; Voltage Rating: 50V; REACH SVHC: No SVHC; Max Operating Temperature: 125°C; Termination: SMD/SMT; Package Quantity: 1; Capacitance: 100nF; Packaging: Tape and Reel; Width: 0.031inch; Depth: 0.8mm; Dielectric: X7R; Tolerance: 20%; Lead Pitch: 0.7mm; Thickness: 0.034inch; Length: 1.6mm; Dielectric Material: Ceramic; Radiation Hardening: No; Voltage Rating (DC): 50V; Case/Package: 0603; Case Code (Metric): 1608; Mount: Surface Mount,PCB; Case Code (Imperial): 0603; JLC_PN: C14663
D1 = CMP-00227-2: ON SEMICONDUCTOR - RB521S30T1G - Small Signal Schottky Diode, Single, 30 V, 200 mA, 500 mV, 1 A, 125 °C; Max Surge Current: 1A; Power Dissipation: 200mW; Forward Voltage: 500mV; Max Reverse Voltage (DC): 30V; Forward Current: 200mA; Polarity: Standard; Max Reverse Current: 30uA; Width: 0.9mm; Min Operating Temperature: -55°C; Radiation Hardening: No; Peak Non-Repetitive Surge Current: 1A; REACH SVHC: No SVHC; Height: 0.7mm; Case/Package: SOD-523-2; Lead Free: Lead Free; Voltage Rating (DC): 30V; Package Quantity: 1; Current Rating: 200mA; Output Current: 200mA; Number of Pins: 2; Max Reverse Leakage Current: 30uA; Max Repetitive Reverse Voltage (Vrrm): 30V; Length: 1.3mm; Contact Plating: Tin,Matte; Max Forward Surge Current (Ifsm): 1A; Max Operating Temperature: 125°C; Element Configuration: Single; Packaging: Tape and Reel; Average Rectified Current: 200mA; RoHS Compliant: Yes
D2 = CMP-00283-1: USB ESD Supressor TVS DIODE 5.25V 17V SOT23-6; Capacitance: 3.5pF; Leakage Current: 150nA; Polarity: Unidirectional,Bidirectional; Min Breakdown Voltage: 6V; Number of Channels: 2; Test Current: 1mA; Data Rate: 480Mbps; Number of Elements: 1; Operating Supply Voltage: 1.1V; ESD Protection: Yes; Working Voltage: 5V; Peak Pulse Current: 5A; Element Configuration: Dual; Contact Plating: Tin,Matte; Reverse Standoff Voltage: 5.25V; Number of Pins: 6; Number of Bidirectional Channels: 2; Radiation Hardening: No; REACH SVHC: No SVHC; Series: USB; Clamping Voltage: 17V; Direction: Unidirectional,Bidirectional; Case/Package: SOT-23; Lead Free: Lead Free; RoHS Compliant: Yes; Min Operating Temperature: -40°C; Mount: Surface Mount; Clamping Voltage-Max: 17V; Depth: 1.75mm; Max Breakdown Voltage: 6V; Height: 1.3mm; Package Quantity: 3000; Width: 1.75mm; Termination: SMD/SMT; Reverse Breakdown Voltage: 6V; Packaging: Tape and Reel; Max Reverse Leakage Current: 150nA; Length: 3.05mm; Max Operating Temperature: 125°C; Breakdown Voltage: 6V; Power Line Protection: Yes
D3 = CMP-00027-2: LED Multicolor Red/True Green/Blue 626nm/528nm/465nm 40mA/50mA/50mA 6-Pin SMD T/R
J3 = CMP-00157-4: KK 254 Breakaway Header, Vertical, 2 Circuits, Tin (Sn) Plating, Mating Pin Length 6.09mm 2 POS; Number of Positions: 2; Voltage Rating (DC): 250V; Contact Resistance: 20mR; Gender: Male; Connector Type: Male Pin; Glow Wire Compliant: Non-compliant; Pitch: 2.54mm; Current Rating: 4A; Orientation: Straight; Flammability Rating: UL94 V-0; Termination: Solder; Mount: Through Hole; Housing Color: Black; Contact Mating Length: 0.24inch; Min Operating Temperature: 0°C; Package Quantity: 1; Color: Black; Voltage Rating: 250V; REACH SVHC: Unknown; Contact Plating: Tin; Packaging: Bulk; Max Voltage Rating (DC): 250V; Max Operating Temperature: 75°C; Number of Circuits: 2; Housing Material: Nylon; Number of Contacts: 2; Lead Free: Lead Free; Radiation Hardening: No; Number of Rows: 1; Contact Material: Brass,Bronze; Mounting Technology: Through Hole; Depth: 2.49mm; Max Voltage Rating (AC): 250V; Series: KK® 42375; Contact Type: Male Pin
J4 = CMP-17439-000164-1: CONN HEADER SMD R/A 6POS 2.5MM; Gender: Male; Number of Positions: 6; Max Current Rating: 3A; Voltage Rating: 250V; Contact Resistance: 20mR; Flammability Rating: UL94 V-0; Orientation: Right Angle; Contact Finish - Mating: TIN; Packaging: Tape and Reel; Termination: Solder; Pitch: 2.5mm; Housing Color: Beige; Insulation Material: Nylon; Fastening Type: Detent; Housing Material: Polyamide; Package Quantity: 1; Mount: Surface Mount; Insulation Color: Natural; Series: XH; Depth: 7mm; Contact Shape: Square; Color: Natural; Max Voltage Rating (AC): 250V; Min Operating Temperature: -25°C; Number of Contacts: 6; Lead Free: Lead Free; Contact Material: Copper Alloy; Contact Type: Male Pin; Length: 20mm; Max Operating Temperature: 85°C; Connector Type: Header; Number of Rows: 1; REACH SVHC: No SVHC; Contact Plating: Copper
J5 = CMP-00209-1: USB Type-C Receptacle for 1.60mm PCB
J7 = CMP-00280-1: 2.50mm Pitch Mini-Lock™ Wire-to-Board Header, Right Angle, Friction and Positive Lock, 4 Circuits; Gender: Male; Current Rating: 3A; Pitch: 2.5mm; Number of Positions: 4; Glow Wire Compliant: Non-compliant; Contact Resistance: 20mR; Voltage Rating: 250V; Packaging: Tray; Min Operating Temperature: -40°C; Number of Rows: 1; Case/Package: 0410; Housing Material: Polyester; Orientation: Right Angle; Color: White; Series: 53426; Contact Material: Bronze; Radiation Hardening: No; Number of Circuits: 4; REACH SVHC: No SVHC; Number of Contacts: 4; Contact Plating: Tin; Package Quantity: 1000; Termination: Through Hole; Max Operating Temperature: 105°C; Contact Gender: Male; Mount: Through Hole; RoHS Compliant: Yes
LS1 = CMP-00287-1: 8.5 mm, 3.6 Vo-p, 85 dB, Surface Mount (SMT), Magnetic Audio Transducer Buzzer
Q1 = CMP-00122-3: 2N7002NXAK - 60 V, single N-channel Trench MOSFET; JLC_PN: C8545
R5 R7-R9 = CMP-00041-3: VISHAY - CRCW06031K00FKEA - SMD Chip Resistor, 0603 [1608 Metric], 1 kohm, CRCW e3 Series, 75 V, Thick Film, 100 mW; Power Rating: 100mW; Resistance: 1kR; Temperature Coefficient: 100ppm/°C; Voltage Rating (DC): 75V; Tolerance: 1%; Case Code (Imperial): 0603; Packaging: Tape and Reel; Composition: Thick Film; Min Operating Temperature: -55°C; Length: 1.55mm; Radiation Hardening: No; Number of Terminations: 2; Contact Plating: Tin; Features: Automotive AEC-Q200; Height: 0.45mm; Max Operating Temperature: 155°C; Termination: SMD/SMT; Package Quantity: 10; Case/Package: 0603; Lead Free: Lead Free; Case Code (Metric): 1608; Width: 0.033inch; Weight: 7.1E-05oz; Mount: Surface Mount; REACH SVHC: Unknown; Number of Pins: 2; Max Power Dissipation: 100mW; Depth: 0.85mm; Voltage Rating: 75V; Military Standard: Not; JLC_PN: C21190
R6 = CMP-00042-5: as R1 on sheet SD_Card; Number of Terminations: 2; Termination: SMD/SMT; Weight: 7.1E-05oz; Contact Plating: Tin,Lead; Max Operating Temperature: 155°C; Voltage Rating (DC): 75V; Military Standard: Not; Min Operating Temperature: -55°C; Depth: 0.85mm; Lead Free: Lead Free; Width: 0.033inch; Max Power Dissipation: 100mW; Features: Automotive AEC-Q200; Number of Pins: 2; Package Quantity: 10; Case/Package: 0603; Height: 0.45mm; Radiation Hardening: No; REACH SVHC: Unknown; Packaging: Tape and Reel; Length: 1.55mm; Case Code (Metric): 1608; Case Code (Imperial): 0603; Composition: Thick Film; JLC_PN: C25804
R10 R11 = CMP-00220-2: Res Thick Film 0603 5.1K Ohm 1% 1/10W ±100ppm/°C Molded SMD SMD Paper T/R; Power Rating: 100mW; Voltage Rating (DC): 75V; Case/Package: 0603; Max Operating Temperature: 155°C; Features: Automotive AEC-Q200; Height: 0.45mm; Series: CRCW; JLC_PN: C23186; Max Power Dissipation: 100mW; Radiation Hardening: No; Depth: 0.85mm; Technology: THICK FILM; Reach SVHC Compliant: Unknown; Package Quantity: 5000; Contact Plating: Tin; Case Code (Metric): 1608; Lead Free: Lead Free; Military Standard: Not; Tolerance: 1%; Resistor Type: Thick Film; Weight: 7.1E-05oz; Resistance Tolerance: 1%; Temperature Coefficient: 100ppm/°C; Termination: SMD/SMT; Min Operating Temperature: -55°C; Construction: Rectangular; RoHS Compliant: Yes; Packaging: Tape and Reel; Number of Terminations: 2; Width: 0.85mm; Voltage Rating: 75V; Case Code (Imperial): 0603; Length: 1.55mm
R14-R16 = CMP-2000-03824-5: Chip Resistor, 100 Ohm, +/- 1%, 100 mW,-55 to 155 degC, 0603 (1608 Metric), RoHS, Tape and Ree; Manufacturer: Vishay Semiconductor; ComponentLink2URL: http://www.vishay.com/docs/20035/dcrcwe3.pdf; ComponentLink1URL: http://www.vishay.com/; Mounting Technology: Surface Mount; ComponentLink1Description: Manufacturer URL; ComponentLink2Description: Datasheet; PackageDescription: 2-Pin Surface Mount Device, Body 1.575 x 0.85 mm; PackageReference: 0603; DatasheetVersion: 06/2012
SW1 = CMP-00028-1: SWITCH TACTILE SPST-NO 0.05A 12V; Actuator Length: 0.4mm; Contact Resistance: 100mR; Mechanical Life: 200000Cycles; Contact Current Rating: 50mA; Illumination Type: Non-Illuminated,Illuminated; Actuator Type: Standard; Ratings: Dust Proof,IP40; Switch Travel: 0.15mm; Throw Configuration: SPST; Operating Force: 1.5N; Switch Function: Off-Mom; Width: 3mm; REACH SVHC: Unknown; Max Voltage Rating (DC): 12V; Packaging: Tape and Reel; Mount: Surface Mount; Max Operating Temperature: 70°C; Min Operating Temperature: -25°C; Length: 4mm; Depth: 2.5mm; Termination: SMD/SMT; Contact Material: Silver; Weight: 0.000776oz; Current Rating: 50mA; Package Quantity: 1; Max Current Rating: 50mA; Lead Free: Lead Free; Voltage Rating (DC): 12V; Electrical Life: 200000Cycles; Insulation Resistance: 100MR; Orientation: Straight; Height: 1.2mm
SWD1 = CMP-00022-1: CONN HEADER 2MM VERT AU 10POS; Contact Resistance: 20mR; Gender: Male; Number of Positions: 10; Row Spacing: 0.079inch; Voltage Rating: 650V; Connector Type: Male Pin; Current Rating: 1A; Package Quantity: 500; Length: 10mm; Packaging: Bulk; Max Operating Temperature: 105°C; Number of Rows: 2; Contact Material: Bronze; Min Operating Temperature: -55°C; Color: Black; Mount: Through Hole; Contact Plating: Gold; REACH SVHC: No SVHC; Depth: 4mm; Radiation Hardening: No; Termination: Solder; Number of Contacts: 10; Orientation: Straight; Pitch: 2mm; Housing Material: Nylon; Contact Mating Length: 0.138inch; Housing Color: Black; Max Current Rating: 1A
U2 = CMP-1063-00192-1: Quad Array for ESD Protection, 5-Pin SOT-553, Pb-Free, Tape and Reel; Manufacturer: On Semiconductor; V(BR) Min (V): 5.32; C Max (pF): 90; Number of Lines: 4; VRWM Max (V): 3; IR Max (uA): 1; PPK Max (W): 100; Direction: Unidirectional; ComponentLink1Description: Manufacturer URL; ComponentLink1URL: http://www.onsemi.com/; DatasheetVersion: Rev. 3; ComponentLink3URL: http://www.onsemi.com/pub_link/Collateral/NZQA5V6AXV5%20SERIES-D.PDF; ComponentLink2URL: http://www.onsemi.com/pub_link/Collateral/NZQA5V6XV5T1-D.PDF; PackageReference: SOT-553-5-463B_B; PartNumber: NZQA5V6XV5T1G; PackageVersion: Rev. B, 05/2005; ComponentLink2Description: Datasheet; Packing: Tape and Reel; PackageDescription: 5-Pin Small Outline Transistor, Body 1.6 x 1.2 mm, Pitch 0.5 mm; ComponentLink3Description: Package Specification; Mounting Technology: Surface Mount; RoHS: Pb-Free

## Sheet Power.SchDoc
size A4; SheetNumber: 5; SheetTotal: 7
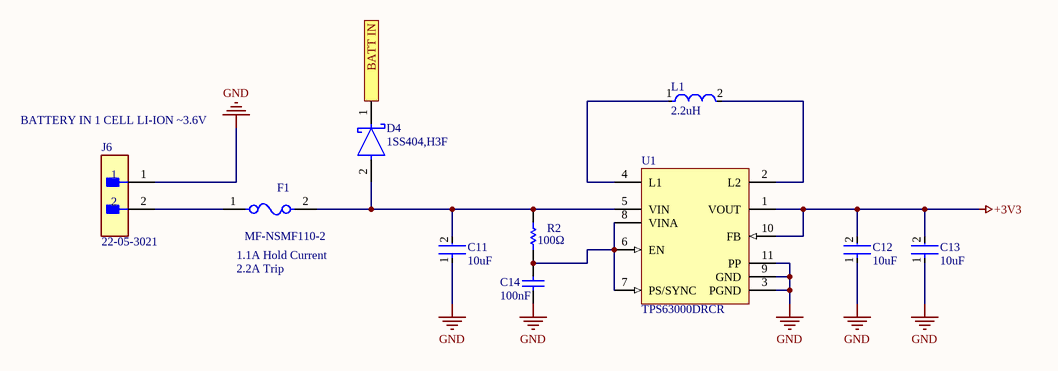
[diagram p6: Power.SchDoc]

### Parts
C11  10uF  [FP-C1608-080-IPC_A]
C12  10uF  [FP-C1608-080-IPC_A]
C13  10uF  [FP-C1608-080-IPC_A]
C14  value 100nF  [CAPC1608X10N]  (hidden comment: C0603C104M5RACTU)
D4  1SS404,H3F  [FP-SOD-323-MFG]
F1  MF-NSMF110-2  [FP-MF-NSMF110-2-MFG]
J6  22-05-3021  [FP-22-05-3021-MFG]
L1  2.2uH  [FP-IHLP-2525BD-FP_2_413x3-MFG]
R2  100Ω  [RESC1609X50X30ML8T20]
U1  TPS63000DRCR  [DRC0010J_V]

### Ports
BATT IN (see Top Level[2D], Flight_Computer[1B])

### Nets
+3V3: C12.2 C13.2 U1.1(VOUT) U1.10(FB)
GND: C11.1 C12.1 C13.1 C14.1 J6.1 U1.3(PGND) U1.9(GND) U1.11(PP)
NetC11_2: C11.2 D4.2(A) F1.2 R2.2 U1.5(VIN)
NetC14_2: C14.2 R2.1 U1.6(EN) U1.7(PS/SYNC) U1.8(VINA)
NetD4_1: D4.1(C) ; port BATT IN
NetF1_1: F1.1 J6.2
NetL1_1: L1.1 U1.4(L1)
NetL1_2: L1.2 U1.2(L2)

### Notes on the sheet
- BATTERY IN 1 CELL LI-ION ~3.6V
- (near F1) 1.1A Hold Current
- 2.2A Trip

### Library data of the parts
C11-C13 = CMP-2000-05442-2: CAP CER 10UF 25V X5R 0603; Dielectric Material: Ceramic; Tolerance: 20%; Dielectric: X5R; Length: 1.6mm; Termination: SMD/SMT; Depth: 0.8mm; RoHS Compliant: Yes; Construction: Flat; Weight: 7.1E-05oz; Thickness: 0.039inch; Packaging: Tape and Reel; Min Operating Temperature: -55°C; Case Code (Imperial): 0603; Case/Package: 0603; Height: 0.8mm; Case Code (Metric): 1608; Voltage Rating: 25V; Resistor Type: Ceramic; Voltage Rating (DC): 25V; Max Operating Temperature: 85°C; REACH SVHC: No SVHC; Lead Free: Lead Free; Series: C; Width: 0.8mm; Mount: Surface Mount; Package Quantity: 1; Capacitance: 10uF
C14 = CMP-00038-5: as C4 on sheet Flight_Computer; Min Operating Temperature: -55°C; Contact Plating: Tin,Matte; Height: 0.8mm; Voltage Rating: 50V; REACH SVHC: No SVHC; Max Operating Temperature: 125°C; Termination: SMD/SMT; Package Quantity: 1; Capacitance: 100nF; Packaging: Tape and Reel; Width: 0.031inch; Depth: 0.8mm; Dielectric: X7R; Tolerance: 20%; Lead Pitch: 0.7mm; Thickness: 0.034inch; Length: 1.6mm; Dielectric Material: Ceramic; Radiation Hardening: No; Voltage Rating (DC): 50V; Case/Package: 0603; Case Code (Metric): 1608; Mount: Surface Mount,PCB; Case Code (Imperial): 0603; JLC_PN: C14663
D4 = CMP-35905-000002-1: DIODE SCHOTTKY 20V 300MA USC; Max Repetitive Reverse Voltage (Vrrm): 25V; Element Configuration: Single; Mount: Surface Mount; Max Reverse Voltage (DC): 20V; Forward Current: 300mA; Packaging: Tape and Reel; Case/Package: SOD; Max Operating Temperature: 100°C; Min Operating Temperature: -40°C; Contact Plating: Tin; Average Rectified Current: 300mA
F1 = CMP-07400-000012-1: PTC RESET FUSE 6V 1.1A 1206; Manufacturer: Bourns; Trip Current: 2.2A; Current Rating: 100A; Trip Time: 0.1s; Resistance: 0.06-0.2Ω; Value: 0.06-0.2Ω; Automotive Grade: Grade 3; Category: Fuse; Digikey Description: PTC RESET FUSE 6V 1.1A 1206; RoHS: TRUE; Temperature: -40°C to +85°C; Lead Free: Yes; Temperature Range High: +85°C; Ambient Temperature Range Low: -40°C; Mouser Description: Resettable Fuses - PPTC 1.1A 6V 0.06ohm; Hold Current: 1.1A; ComponentLink2URL: https://www.bourns.com/docs/Product-Datasheets/mfnsmf.pdf; Height: 0.7mm; Device Class L2: PTC Resettable Fuses; ComponentLink2Description: Datasheet; Automotive: Yes; Ambient Temperature Range High: +85°C; Temperature Range Low: -40°C; Device Class L1: Circuit Protection; Octopart: https://octopart.com/mf-nsmf110-2-bourns-41795; Voltage Rating: 6V; Package: MF-NSMF110-2; Manufacturer Part Number: MF-NSMF110-2; Device Class L3: unset
J6 = CMP-04776-000166-1: CONN HEADER R/A 2POS 2.54MM; Glow Wire Compliant: Non-compliant; Max Current Rating: 4A; Number of Positions: 2; Contact Resistance: 10mR; Max Voltage Rating (AC): 250V; Gender: Male; Approvals: UL; Contact Material: Brass; Halogen Free: Low Halogen; Depth: 12.83mm; Color: White; Mount: Through Hole; Housing Color: White; Package Quantity: 3000; Series: KK® 7478; Packaging: Bulk; Length: 5.08mm; Fastening Type: Friction; Contact Plating: Tin; Flammability Rating: UL94 V-0; Housing Material: Nylon; Current Rating: 4A; Max Operating Temperature: 75°C; Height: 6.35mm; Lead Free: Lead Free; Pitch: 2.54mm; Termination: Solder; Min Operating Temperature: 0°C; Voltage Rating: 250V; Radiation Hardening: No; Number of Contacts: 2; Contact Mating Length: 0.264inch; Orientation: Right Angle; Contact Type: Male Pin; Number of Rows: 1; Number of Circuits: 2
L1 = CMP-02424-000562-1: Commercial Inductors, High Saturation Series 2.2uH 6.5A 34mΩ 20%; Saturation Current: 14A; Self Resonant Frequency: 5MHz; Core Material: Metal; DC Resistance (DCR): 34mR; Shielding: Shielded; Test Frequency: 100kHz; Mount: Surface Mount; Contact Plating: Tin; Inductance Tolerance: 20%; Depth: 6.72mm; Width: 0.255inch; Max DC Current: 6.5A; Height - Seated (Max): 0.094inch; Max Operating Temperature: 125°C; Case Code (Metric): 6363; RMS Current (Irms): 6.5A; Lead Free: Lead Free; Current Rating: 6.5A; Min Operating Temperature: -55°C; Package Quantity: 2000; Case/Package: 2525; Radiation Hardening: No; Military Standard: Not; Termination: SMD/SMT; Length: 7.24mm; Case Code (Imperial): 2525; Height: 2.4mm; Number of Pins: 2525; Packaging: Tape and Reel; Inductance: 2.2uH; Tolerance: 20%
R2 = CMP-2000-03824-5: as R14 on sheet IO; ComponentLink2URL: http://www.vishay.com/docs/20035/dcrcwe3.pdf; ComponentLink1URL: http://www.vishay.com/; Mounting Technology: Surface Mount; ComponentLink1Description: Manufacturer URL; ComponentLink2Description: Datasheet; PackageDescription: 2-Pin Surface Mount Device, Body 1.575 x 0.85 mm; PackageReference: 0603; DatasheetVersion: 06/2012
U1 = CMP-019-00049-1: Switching Regulator, Current-mode, 0.8A, 1500kHz Switching Freq-Max, PDSO10; Frequency: 1.5MHz; Max Supply Voltage: 5.5V; Pins: 10; Min Operating Temperature: -40°C; Max Operating Temperature: 85°C; RoHS Compliant: Yes; Case/Package: HVSON